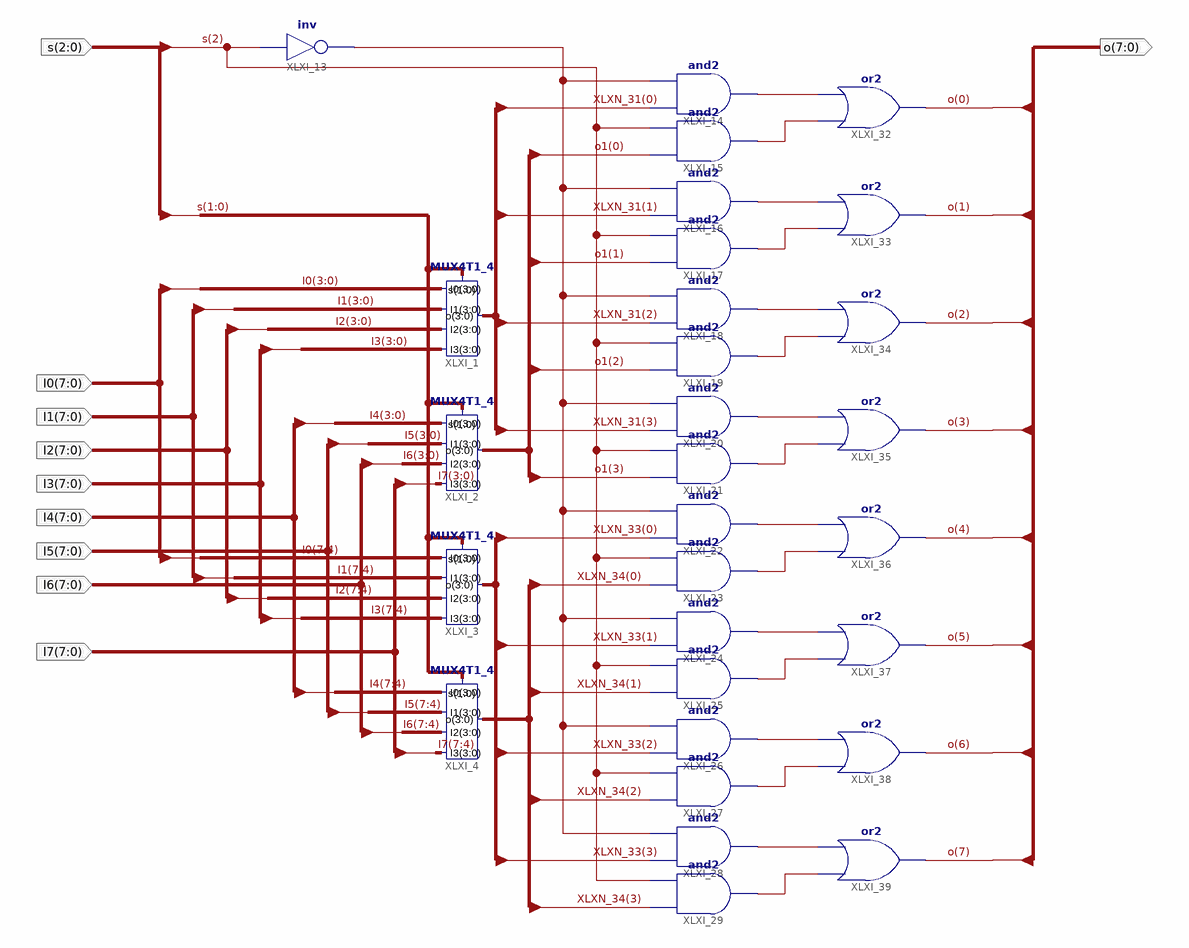
[diagram p0: schematic sheet 1]
// Xilinx ISE schematic MUX8T1_8.sch (kintex7) as structural Verilog: 29 symbols, 10 ports
module MUX8T1_8 (
  input  [7:0] I0,
  input  [7:0] I1,
  input  [7:0] I2,
  input  [7:0] I3,
  input  [7:0] I4,
  input  [7:0] I5,
  input  [7:0] I6,
  input  [7:0] I7,
  input  [2:0] s,
  output [7:0] o
);

  wire XLXN_55, XLXN_56, XLXN_57, XLXN_60, XLXN_61, XLXN_63, XLXN_64, XLXN_65, XLXN_66, XLXN_67, XLXN_68,
       XLXN_69, XLXN_70, XLXN_71, XLXN_72, XLXN_73, XLXN_74;
  wire [3:0] o1, XLXN_31, XLXN_33, XLXN_34;

  MUX4T1_4 XLXI_2 (.I3(I7[3:0]), .I2(I6[3:0]), .I1(I5[3:0]), .I0(I4[3:0]), .s(s[1:0]), .o(o1));
  MUX4T1_4 XLXI_3 (.I3(I3[7:4]), .I2(I2[7:4]), .I1(I1[7:4]), .I0(I0[7:4]), .s(s[1:0]), .o(XLXN_33));
  MUX4T1_4 XLXI_4 (.I3(I7[7:4]), .I2(I6[7:4]), .I1(I5[7:4]), .I0(I4[7:4]), .s(s[1:0]), .o(XLXN_34));
  MUX4T1_4 XLXI_1 (.I3(I3[3:0]), .I2(I2[3:0]), .I1(I1[3:0]), .I0(I0[3:0]), .s(s[1:0]), .o(XLXN_31));
  and XLXI_14 (XLXN_56, XLXN_31[0], XLXN_55);
  and XLXI_15 (XLXN_57, o1[0], s[2]);
  and XLXI_16 (XLXN_60, XLXN_31[1], XLXN_55);
  and XLXI_17 (XLXN_61, o1[1], s[2]);
  and XLXI_18 (XLXN_63, XLXN_31[2], XLXN_55);
  and XLXI_19 (XLXN_64, o1[2], s[2]);
  and XLXI_20 (XLXN_65, XLXN_31[3], XLXN_55);
  and XLXI_21 (XLXN_66, o1[3], s[2]);
  and XLXI_22 (XLXN_67, XLXN_33[0], XLXN_55);
  and XLXI_23 (XLXN_68, XLXN_34[0], s[2]);
  and XLXI_24 (XLXN_69, XLXN_33[1], XLXN_55);
  and XLXI_25 (XLXN_70, XLXN_34[1], s[2]);
  and XLXI_26 (XLXN_71, XLXN_33[2], XLXN_55);
  and XLXI_27 (XLXN_72, XLXN_34[2], s[2]);
  and XLXI_28 (XLXN_73, XLXN_33[3], XLXN_55);
  and XLXI_29 (XLXN_74, XLXN_34[3], s[2]);
  not XLXI_13 (XLXN_55, s[2]);
  or XLXI_32 (o[0], XLXN_57, XLXN_56);
  or XLXI_33 (o[1], XLXN_61, XLXN_60);
  or XLXI_34 (o[2], XLXN_64, XLXN_63);
  or XLXI_35 (o[3], XLXN_66, XLXN_65);
  or XLXI_36 (o[4], XLXN_68, XLXN_67);
  or XLXI_37 (o[5], XLXN_70, XLXN_69);
  or XLXI_38 (o[6], XLXN_72, XLXN_71);
  or XLXI_39 (o[7], XLXN_74, XLXN_73);
endmodule
